# Altium schematic sheet Methane Sensor.SchDoc
size D; SheetNumber: 1; SheetTotal: 1
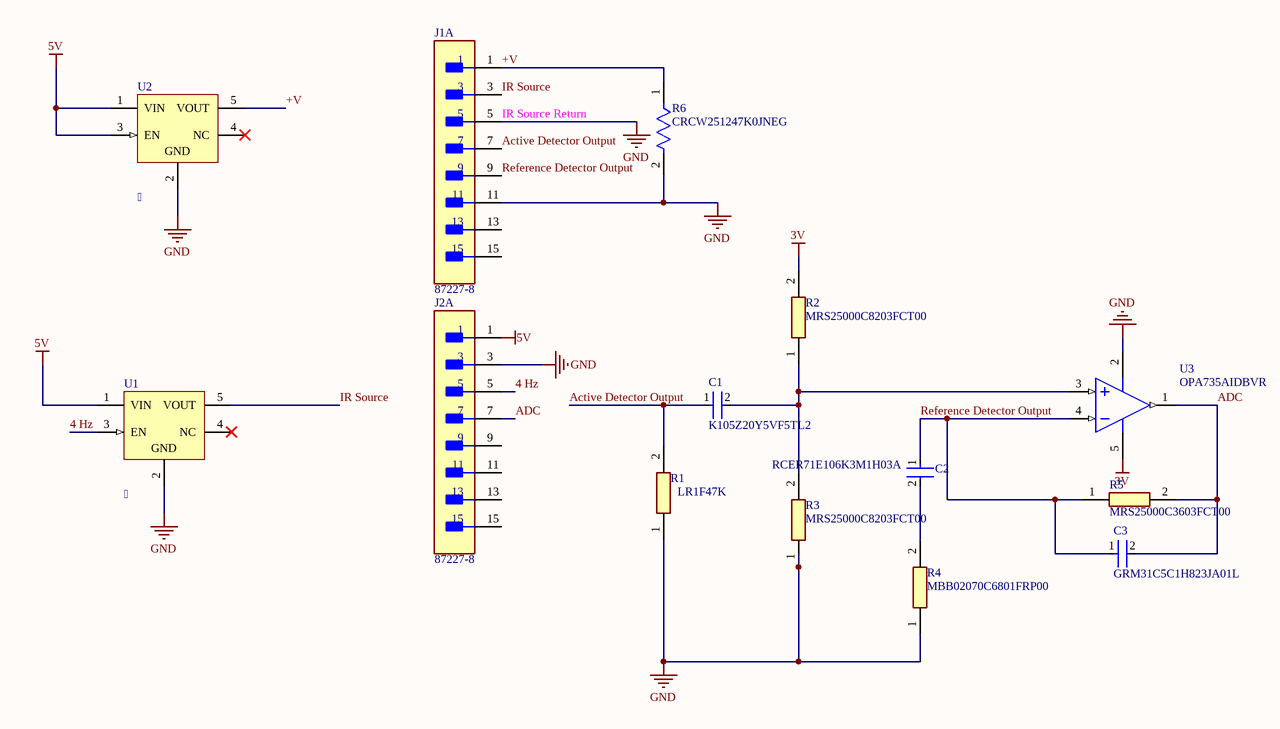
[diagram p0: Methane Sensor.SchDoc]

## Parts
C1  K105Z20Y5VF5TL2  [FP-K105Z20Y5VF5TL2-MFG]
C2  RCER71E106K3M1H03A  [FP-RCE3M1-MFG]
C3  GRM31C5C1H823JA01L  [FP-GRM31C-0_2-e0_3_0_8-IPC_A]
J1  87227-8  [FP-87227-8-MFG]  (part A of 2)
J2  87227-8  [FP-87227-8-MFG]  (part A of 2)
R1  LR1F47K  [RESAD1540W55L620D230]
R2  MRS25000C8203FCT00  [RESAD1650W60L650D250]
R3  MRS25000C8203FCT00  [RESAD1650W60L650D250]
R4  MBB02070C6801FRP00  [RESAD1650W60L650D250]
R5  MRS25000C3603FCT00  [RESAD1650W60L650D250]
R6  CRCW251247K0JNEG  [FP-CRCW2512-e3-IPC_A]
U1    [ADI-UJ-5_M]
U2    [ADI-UJ-5_M]
U3  OPA735AIDBVR  [DBV0005A_N]

## Nets
3V: R2.2 U3.5(V+)
5V: J2.1 U1.1(VIN) U2.1(VIN) U2.3(EN)
GND: J1.5 J1.11 J2.3 R1.1 R3.1 R4.1 R6.2 U1.2(GND) U2.2(GND) U3.2(V-)
4 Hz: J2.5 U1.3(EN)
+V: J1.1 R6.1 U2.5(VOUT)
Active Detector Output: C1.1 J1.7 R1.2
ADC: C3.2 J2.7 R5.2 U3.1(OUT)
IR Source: J1.3 U1.5(VOUT)
Reference Detector Output: C2.1 C3.1 J1.9 R5.1 U3.4(IN-)
NetC1_2: C1.2 R2.1 R3.2 U3.3(IN+)
NetC2_2: C2.2 R4.2

Not connected (* = marked no-connect by the designer): J1 13 15; J2 9 11 13 15; U1 4(NC)*; U2 4(NC)*

## Notes on the sheet
- (near J1) IR Source Return

## Library data of the parts
C1 = CMP-02417-000003-1: CAP CER 1UF 50V Y5V RADIAL; Manufacturer: Vishay BC Components; Tolerance: -20+80%; Material: Ceramic; Capacitance: 1uF; Temperature Characteristic: Y5V; Mouser Description: Multilayer Ceramic Capacitors MLCC - Leaded 1uF 50volts +80/-20% Y5V 2.5mm LS; Lead Free: Yes; RoHS: TRUE; Voltage Rating: 50V; Device Class L1: Passive Components; Octopart: https://octopart.com/k105z20y5vf5tl2-vishay-39475252; Temperature Range Low: -30°C; Digikey Description: CAP CER 1UF 50V Y5V RADIAL; Manufacturer Part Number: K105Z20Y5VF5TL2; Device Class L2: Capacitors; Temperature: -30°C to +85°C; Package: K105Z20Y5VF5TL2; Temperature Range High: +85°C; ComponentLink2Description: Datasheet; Value: 1uF; Category: Cap; Height: 6.6mm; ComponentLink2URL: https://www.vishay.com/docs/45171/kseries.pdf; Device Class L3: Ceramic Capacitors; Automotive: No
C2 = CMP-06035-005744-1: Cap Ceramic 10uF 25V X7R ±10% Radial 5mm +125°C Automotive Ammo Pack; Lead/Base Style: Formed Leads; Lead Diameter: 0.5mm; Length: 0.217inch; Package Quantity: 1500; Width: 0.157inch; Resistor Type: Ceramic; Height - Seated (Max): 0.197inch; Ratings: AEC-Q200; Lead Pitch: 0.197inch; Packaging: Tape and Reel; Tolerance: 10%; Voltage Rating (DC): 25V; Capacitance: 10uF; Termination: Radial; Mount: Through Hole; Voltage Rating: 25V; Min Operating Temperature: -55°C; Height: 5mm; Dielectric: X7R; Max Operating Temperature: 125°C; Case/Package: Radial
C3 = CMP-06035-048477-1: Chip Multilayer Ceramic Capacitors for General Purpose, 1206, 82000pF, C0G, 30ppm/°C, 5%, 50V; Capacitance: 82nF; Mount: Surface Mount; Tolerance: 5%; Thickness: 0.071inch; Voltage Rating: 50V; Depth: 1.6mm; Package Quantity: 1; Radiation Hardening: No; Max Operating Temperature: 125°C; Case/Package: 1206; Length: 3.2mm; Packaging: Tape and Reel; Min Operating Temperature: -55°C; Termination: SMD/SMT; Dielectric: C0G; Voltage: 50V; Case Code (Imperial): 1206; Lead Free: Lead Free; Case Code (Metric): 3216; Height: 1.6mm; Voltage Rating (DC): 50V; Width: 0.063inch
J1 J2 = CMP-03369-000064-1: CONN HEADER VERT 16POS 2.54MM; Manufacturer: TE Connectivity; Conn Gender: Male; Conn Orientation: Straight; Current Rating: 3A; Number Of Contacts: 16; Mouser Description: Headers & Wire Housings UNSHRD VERT DUAL 16; Lead Free: Yes; Digikey Description: CONN HEADER VERT 16POS 2.54MM; Device Class L3: unset; Automotive: No; Height: 0.428inch; Temperature Range Low: -65°C; Device Class L1: Connectors; RoHS: TRUE; Pitch: 2.54mm; Package: 0; Manufacturer Part Number: 87227-8; Number Of Rows: 2; Footprint Url: https://www.te.com/commerce/DocumentDelivery/DDEController?Action=showdoc&DocId=Customer+Drawing%7F87227%7FH4%7Fpdf%7FEnglish%7FENG_CD_87227_H4.pdf%7F87227-8; ComponentLink2URL: https://www.te.com/usa-en/product-87227-8.datasheet.pdf; ComponentLink2Description: Datasheet; Temperature: -65°C to +105°C; Category: Conn; Temperature Range High: +105°C; Octopart: https://octopart.com/87227-8-te+connectivity-39407754; Device Class L2: Headers and Wire Housings; Contact Material: Gold,Nickel
R1 = LR1F47K: Resistor; Manufacturer_Name: TE Connectivity; Datasheet Link: https://componentsearchengine.com/Datasheets/2/LR1F47K.pdf; Manufacturer_Part_Number: LR1F47K; Mouser Part Number: 279-LR1F47K; Mouser Price/Stock: https://www.mouser.co.uk/ProductDetail/TE-Connectivity-Holsworthy/LR1F47K?qs=ip69W3eHERWQ8q3y81tH5w%3D%3D; Arrow Part Number: LR1F47K; Arrow Price/Stock: https://www.arrow.com/en/products/lr1f47k/te-connectivity
R2 R3 = MRS25000C8203FCT00: Resistor; Manufacturer_Name: Vishay; Datasheet Link: http://www.vishay.com/docs/28724/mrs16m25.pdf; Manufacturer_Part_Number: MRS25000C8203FCT00
R4 = MBB02070C6801FRP00: Resistor; Manufacturer_Name: Vishay; Datasheet Link: https://componentsearchengine.com/Datasheets/1/MBB02070C6801FRP00.pdf; Manufacturer_Part_Number: MBB02070C6801FRP00; Mouser Part Number: 594-MBB02070C6801FRP; Mouser Price/Stock: https://www.mouser.co.uk/ProductDetail/Vishay-Beyschlag/MBB02070C6801FRP00?qs=LkqrmUh5PIIetlOD9qrCQg%3D%3D
R5 = MRS25000C3603FCT00: Resistor; Manufacturer_Name: Vishay; Datasheet Link: http://www.vishay.com/docs/28724/mrs16m25.pdf; Manufacturer_Part_Number: MRS25000C3603FCT00; Mouser Part Number: N/A; Mouser Price/Stock: http://www.mouser.com/Search/ProductDetail.aspx?qs=vcbl%252bK4rRlcCDVZNdOBzYg%3d%3d
R6 = CMP-1018-00114-2: RES Thick Film, 47kΩ, 5%, 1W, 200ppm/°C, 2512; Voltage Rating (DC): 500V; Resistance: 47kR; Number of Terminations: 2; Tolerance: 5%; Package Quantity: 1; Case Code (Metric): 6432; Composition: Thick Film; Max Power Dissipation: 1W; Min Operating Temperature: -55°C; Height: 0.6mm; Features: Automotive AEC-Q200; Weight: 0.001429oz; Lead Free: Lead Free; Termination: SMD/SMT; Max Operating Temperature: 155°C; Depth: 3.15mm; Temperature Coefficient: 200ppm/°C; Power Rating: 1W; Width: 3.15mm; Case Code (Imperial): 2512; Contact Plating: Tin; Voltage Rating: 500V; Packaging: Tape and Reel; Case/Package: 2512; Length: 6.3mm; Military Standard: Not
U1 U2 = CMP-0786-00350-1: 300 mA, Low Quiescent Current, CMOS Linear Regulator, 2.3 to 5.5 V Vin, 3 V Vout, Industrial, 5-pin SOT23 (UJ-5), Reel; PartNumber: ADP122AUJZ-3.0-R7; Manufacturer: Analog Devices; Vin (max) (V): 5.5; Vin (min) (V): 2.3; Preset Vout Values (V): 3.0; Iout max: 300mA; Supply Current IGND @ Small Load: 45uA; ComponentLink3Description: Package Specification; ComponentLink1URL: http://www.analog.com/en/index.html; ComponentLink3URL: http:/www.analog.com/static/imported-files/packages/PKG_PDF/TSOT(UJ)/UJ_5.pdf; PackageVersion: 100708-A, 10/2008; DatasheetVersion: Rev. E; ComponentLink1Description: Manufacturer URL; ComponentLink2Description: Datasheet; ComponentLink2URL: http://www.analog.com/static/imported-files/data_sheets/ADP122_123.pdf; ComponentLink4URL: Product URL:http://www.analog.com/en/ADP122/productSearch.html; ComponentLink4Description: URL Link1; Packing: Reel; PackageDescription: 5-Pin Thin Small Outline Transistor Package, Body 2.9 x 1.6 mm, Pitch 0.95 mm; PackageReference: UJ-5; Mounting Technology: Surface Mount; Code_JEDEC: MO-193-AB
U3 = CMP-0272-02194-3: 0.05 uV/degC (Max), Single-Supply CMOS Zero-Drift Series Operational Amplifier, 2.7 to 12 V, -40 to 85 degC, 5-pin SOT23 (DBV5), Green (RoHS & no Sb/Br); Manufacturer: Texas Instruments; Offset Drift(Typ)(uV/C): 0.01; Packing: LARGE T&R; Total Supply Voltage(Max)(+5V is 5, +/-5V is 10): 12; GBW(Typ)(MHz): 1.6; Slew Rate(Typ)(V/us): 1.5; Number of Channels: 1; Sub Family: Low Offset Voltage Amplifier (<=500uV), Low Supply Voltage Amplifier (<=2.7V), Precision Amplifier, Zero Drift Precision Amplifier; Vio (25C)(Max)(mV): 0.005; Rating: Catalog; CMRR(Min)(dB): 115; IIB(Max)(pA): 200; Iq per channel(Max)(mA): 0.75; Total Supply Voltage(Min)(+5V is 5, +/-5V is 10): 2.7; ComponentLink1URL: http://www.ti.com/; Mounting Technology: Surface Mount; PartNumber: OPA735AIDBVR; Eco-Plan: Green (RoHS & no Sb/Br); PackageReference: DBV0005A; PackageDescription: 5-Pin Plastic Small Outline, Body 1.6 x 2.9 mm, Pitch 0.95 mm; PackageVersion: 4073253-4/K, 03/2006; ComponentLink2Description: Datasheet; ComponentLink1Description: Manufacturer URL; DatasheetVersion: SBOS282B; ComponentLink3Description: Package Specification; Code_JEDEC: MO-178; ComponentLink3URL: http://www.ti.com/litv/pdf/mpds018i; ComponentLink2URL: http://www.ti.com/lit/ds/symlink/opa735.pdf